# EAGLE schematic PTGSCH1 (EAGLE 7.7.0)

## Sheet 1 of 2
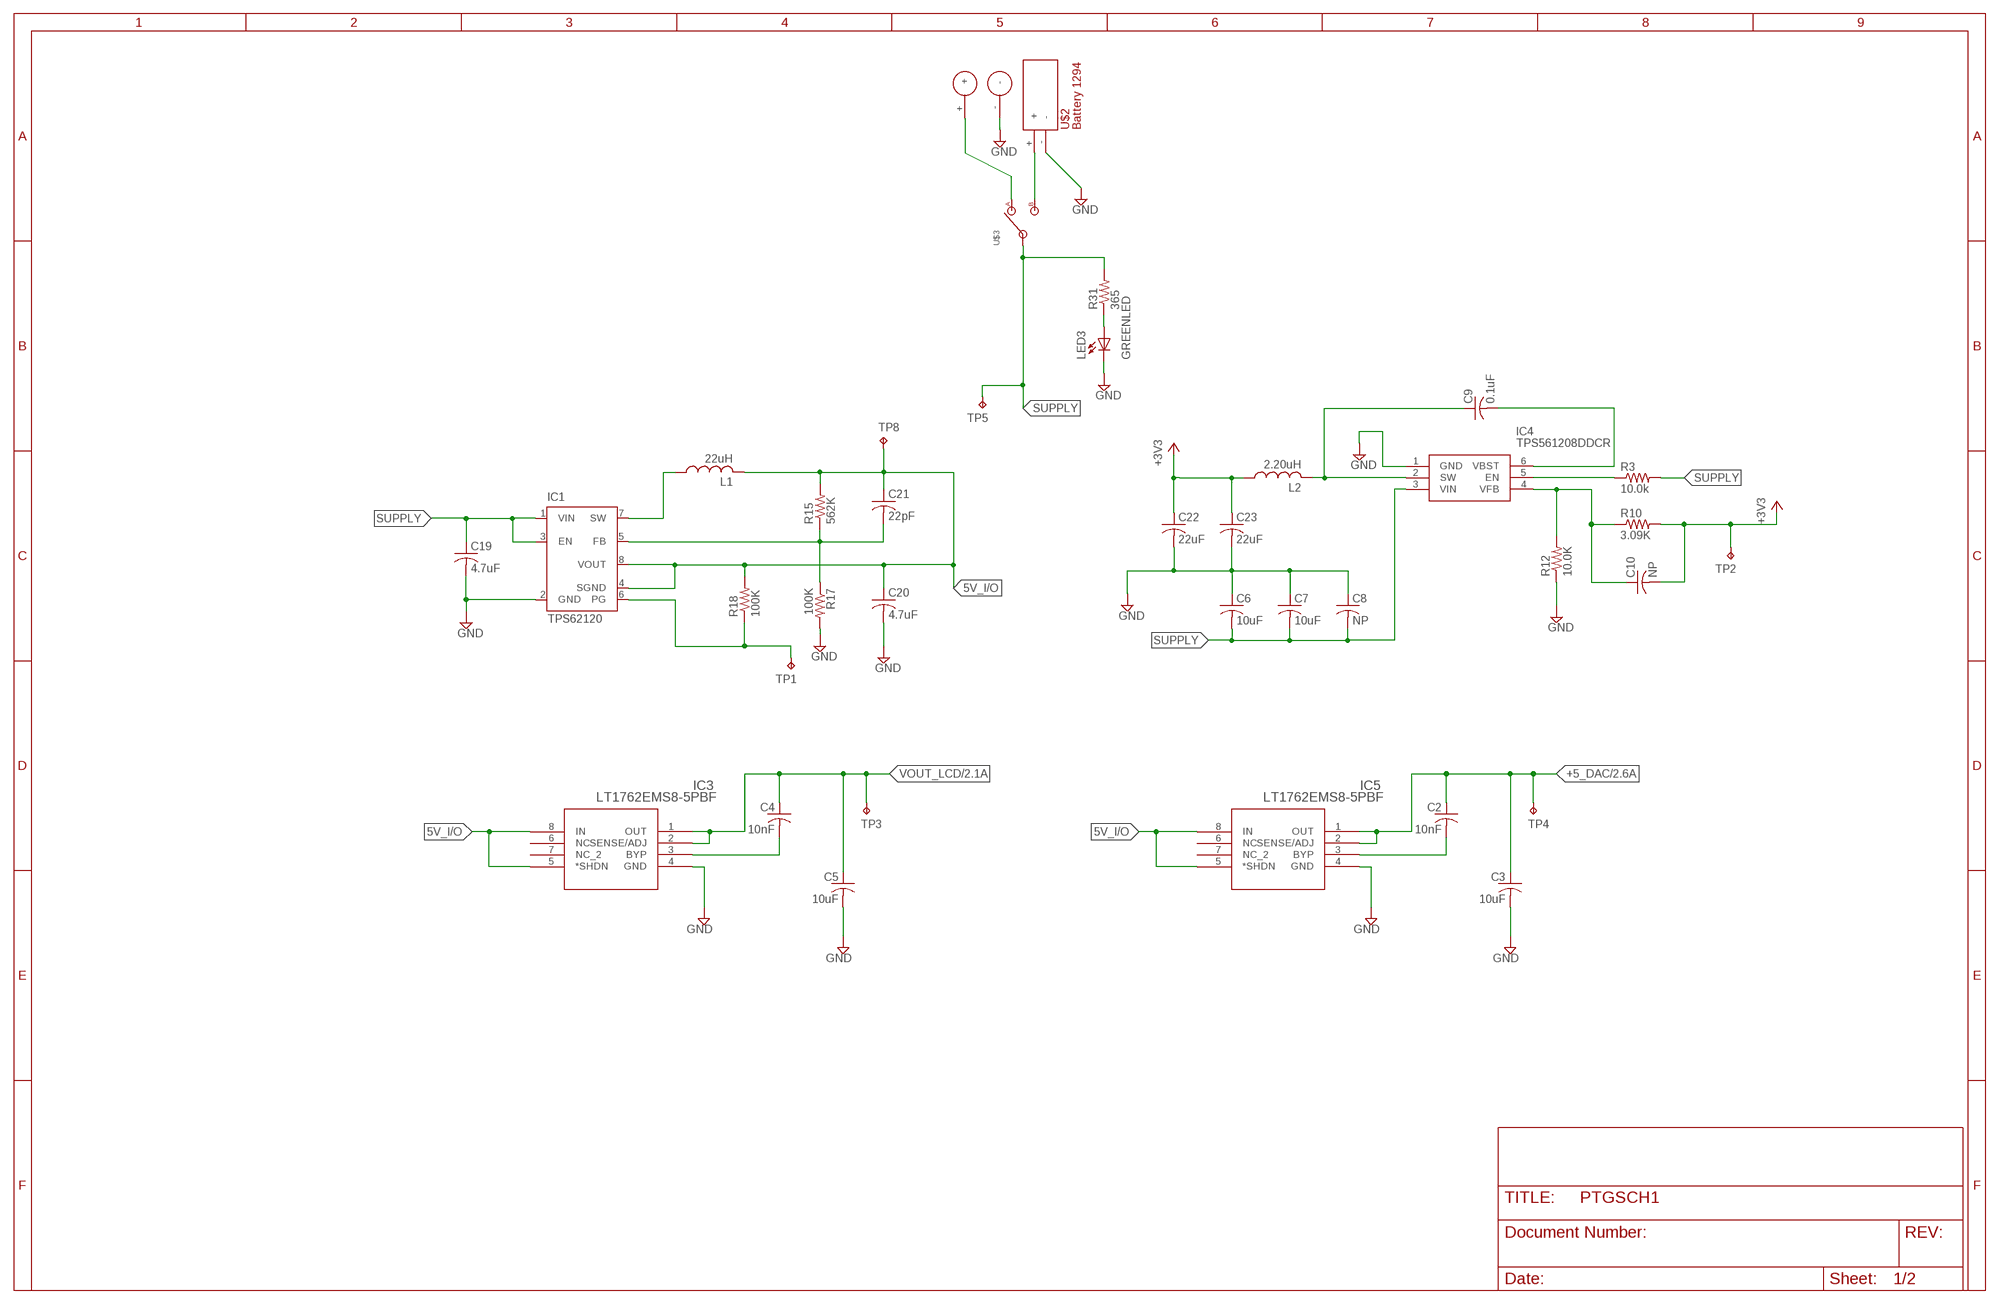
[diagram p0: schematic, sheet 1]

### Parts
C2  10nF  C-USC0603  [C0603]
C3  10uF  C-USC0805  [C0805]
C4  10nF  C-USC0603  [C0603]
C5  10uF  C-USC0805  [C0805]
C6  10uF  C-USC0805  [C0805]
C7  10uF  C-USC0805  [C0805]
C8  NP  C-USC0805  [C0805]
C9  0.1uF  C-USC0805  [C0805]
C10  NP  C-USC0805  [C0805]
C19  4.7uF  C-USC0603  [C0603]
C20  4.7uF  C-USC0603  [C0603]
C21  22pF  C-USC0603  [C0603]
C22  22uF  C-USC0603  [C0603]
C23  22uF  C-USC0603  [C0603]
IC1  TPS62120  [DCN-R-PDSO-G8]
IC3  LT1762EMS8-5PBF  [MSOP-8_MS]
IC4  TPS561208DDCR  [SOT95P280X110-6N]
IC5  LT1762EMS8-5PBF  [MSOP-8_MS]
L1  22uH  L-US0603  [C0603K]
L2  2.20uH  L-US0603  [C0603K]
LED3  GREENLED  [0805_10MGAP]
R3  10.0k  R-US_R0603  [R0603]
R10  3.09K  R-US_R0603  [R0603]
R12  10.0K  R-US_R0603  [R0603]
R15  562K  R-US_R0603  [R0603]
R17  100K  R-US_R0603  [R0603]
R18  100K  R-US_R0603  [R0603]
R31  365  R-US_R0603  [R0603]
TP1  TPTP20SQ  [TP20SQ]
TP2  TPTP20SQ  [TP20SQ]
TP3  TPTP20SQ  [TP20SQ]
TP4  TPTP20SQ  [TP20SQ]
TP5  TPTP20SQ  [TP20SQ]
TP8  TPTP20SQ  [TP20SQ]
U$2  BATTERY_HOLDER  [HOLDER]
U$3  POWERSWITCH  [ROCKERVIAS]
U$4  POWRPINS  [VOLTAGEPINS]

### Nets
5V_I/O: C20.1 C21.1 IC1.4(SGND) IC1.8(VOUT) IC3.5(*SHDN) IC3.8(IN) IC5.5(*SHDN) IC5.8(IN) L1.2 R15.2 R18.2 TP8.TP
+3V3: C10.2 C22.1 C23.1 L2.1 R10.2 TP2.TP ; also sheet 2
+5_DAC: C2.1 C3.1 IC5.1(OUT) IC5.2(SENSE/ADJ) TP4.TP ; also sheet 2
ADD_TEST_PAD: IC1.6(PG) R18.1 TP1.TP
GND: C3.2 C5.2 C6.1 C7.1 C8.1 C19.2 C20.2 C22.2 C23.2 IC1.2(GND) IC3.4(GND) IC4.1(GND) IC5.4(GND) LED3.1(-) R12.1 R17.2 U$2.- U$4.- ; also sheet 2
N$1: U$2.+ U$3.3
N$2: C10.1 IC4.4(VFB) R10.1 R12.2
N$4: C9.1 IC4.2(SW) L2.2
N$5: C9.2 IC4.6(VBST)
N$6: IC4.5(EN) R3.1
N$7: IC1.7(SW) L1.1
N$8: C21.2 IC1.5(FB) R15.1 R17.1
N$9: C2.2 IC5.3(BYP)
N$13: LED3.2(+) R31.1
N$23: C4.2 IC3.3(BYP)
PWR_PINS: U$3.1 U$4.+
SUPPLY: C6.2 C7.2 C8.2 C19.1 IC1.1(VIN) IC1.3(EN) IC4.3(VIN) R3.2 R31.2 TP5.TP U$3.2
VOUT_LCD: C4.1 C5.1 IC3.1(OUT) IC3.2(SENSE/ADJ) TP3.TP ; also sheet 2
Unconnected: IC3.6(NC) IC3.7(NC_2) IC5.6(NC) IC5.7(NC_2)

## Sheet 2 of 2
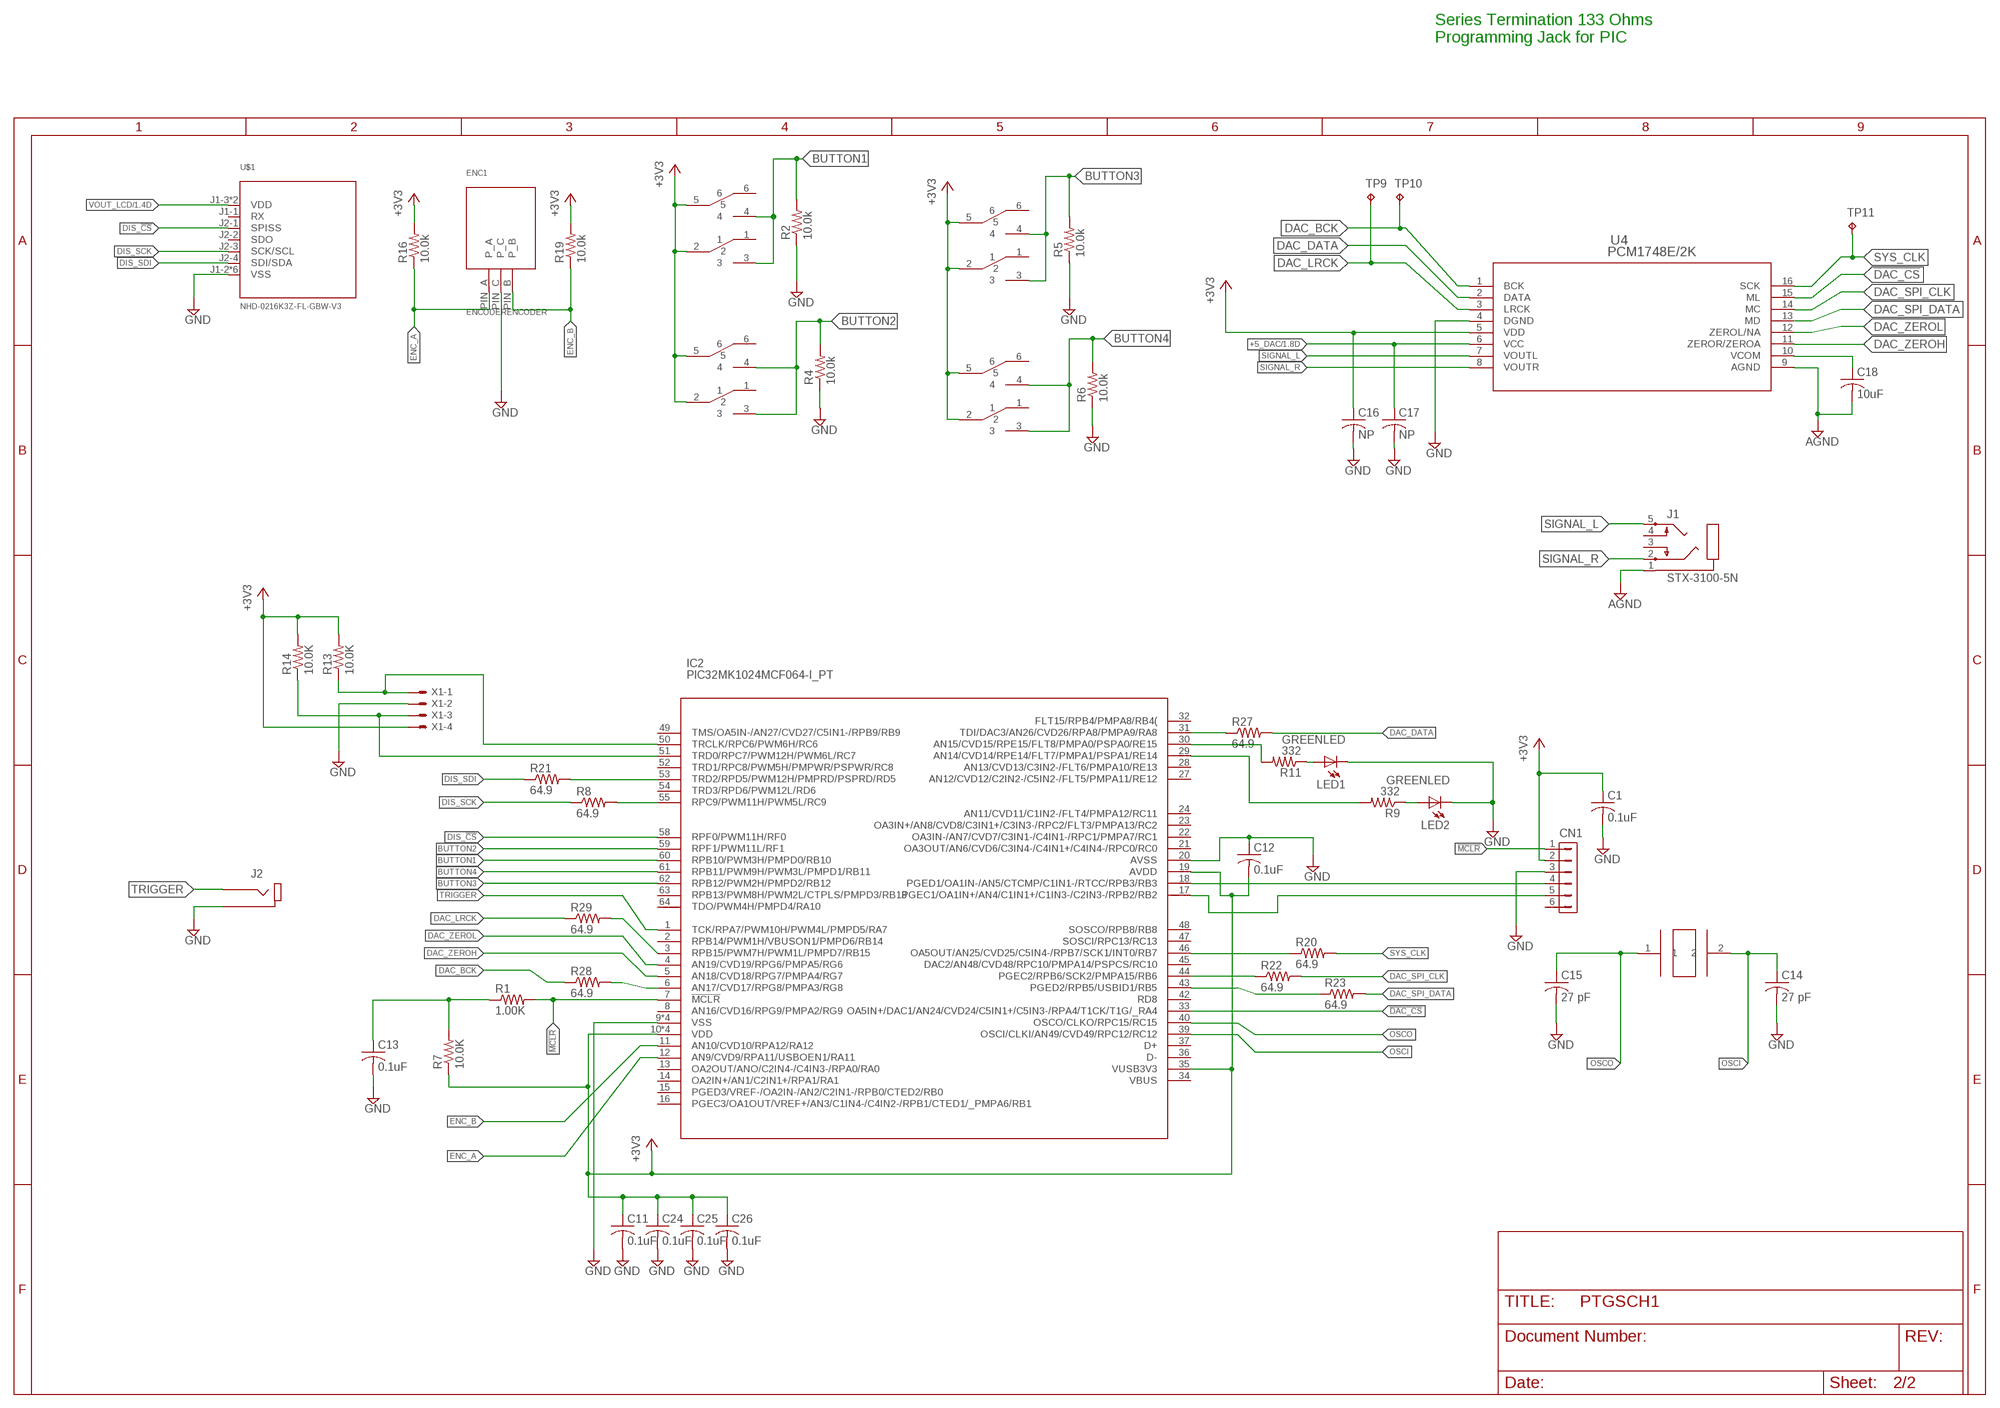
[diagram p1: schematic, sheet 2]

### Parts
BUTTON1  BUTTON-DPDT-7MM  [BUTTON-DPDT-7MM]
BUTTON2  BUTTON-DPDT-7MM  [BUTTON-DPDT-7MM]
BUTTON3  BUTTON-DPDT-7MM  [BUTTON-DPDT-7MM]
BUTTON4  BUTTON-DPDT-7MM  [BUTTON-DPDT-7MM]
C1  0.1uF  C-USC0805  [C0805]
C11  0.1uF  C-USC0805  [C0805]
C12  0.1uF  C-USC0805  [C0805]
C13  0.1uF  C-USC0805  [C0805]
C14  27 pF  C-USC0603  [C0603]
C15  27 pF  C-USC0603  [C0603]
C16  NP  C-USC0805  [C0805]
C17  NP  C-USC0805  [C0805]
C18  10uF  C-USC0805  [C0805]
C24  0.1uF  C-USC0805  [C0805]
C25  0.1uF  C-USC0805  [C0805]
C26  0.1uF  C-USC0805  [C0805]
CN1  HDR-1X6-SIP-100  [SIP-100-6V]
ENC1  ENCODERENCODER  [ENCODER]
IC2  PIC32MK1024MCF064-I_PT  [TQFP64-10X10]
J1  STX-3100-5N  [STX-3100-5N]
J2  RCJ-01X_PHONO_SINGLE  [RCA_RA_PCB_SINGLE]
LED1  GREENLED  [0805_10MGAP]
LED2  GREENLED  [0805_10MGAP]
R1  1.00K  R-US_R0603  [R0603]
R2  10.0k  R-US_R0603  [R0603]
R4  10.0k  R-US_R0603  [R0603]
R5  10.0k  R-US_R0603  [R0603]
R6  10.0k  R-US_R0603  [R0603]
R7  10.0K  R-US_R0603  [R0603]
R8  64.9  R-US_R0603  [R0603]
R9  332  R-US_R0603  [R0603]
R11  332  R-US_R0603  [R0603]
R13  10.0K  R-US_R0603  [R0603]
R14  10.0K  R-US_R0603  [R0603]
R16  10.0k  R-US_R0603  [R0603]
R19  10.0k  R-US_R0603  [R0603]
R20  64.9  R-US_R0603  [R0603]
R21  64.9  R-US_R0603  [R0603]
R22  64.9  R-US_R0603  [R0603]
R23  64.9  R-US_R0603  [R0603]
R27  64.9  R-US_R0603  [R0603]
R28  64.9  R-US_R0603  [R0603]
R29  64.9  R-US_R0603  [R0603]
TP9  TPTP20SQ  [TP20SQ]
TP10  TPTP20SQ  [TP20SQ]
TP11  TPTP20SQ  [TP20SQ]
U4  PCM1748E/2K  [DBQ16]
U$1  NHD-0216K3Z-FL-GBW-V3  [NHD-0216K3Z-FL-GBW-V3]
U$8  EXTERNALCRYSTAL  [XTAL500X320X130N]
X1  22-23-2041  [22-23-2041]

### Nets
!DAC_CS: IC2.33(OA5IN+/DAC1/AN24/CVD24/C5IN1+/C5IN3-/RPA4/T1CK/T1G/_RA4) U4.15(ML)
!MCLR: CN1.1 IC2.7(!MCLR) R1.2
+3V3: BUTTON1.2 BUTTON1.5 BUTTON2.2 BUTTON2.5 BUTTON3.2 BUTTON3.5 BUTTON4.2 BUTTON4.5 C1.1 C11.1 C12.2 C16.1 C24.1 C25.1 C26.1 CN1.2 IC2.10(VDD) IC2.19(AVDD) IC2.26(VDD) IC2.35(VUSB3V3) IC2.38(VDD) IC2.57(VDD) R7.1 R13.2 R14.2 R16.2 R19.2 U4.5(VDD) X1.4 ; also sheet 1
+5_DAC: C17.1 U4.6(VCC) ; also sheet 1
AGND: C18.2 J1.1 U4.9(AGND)
BUTTON1: BUTTON1.3 BUTTON1.4 IC2.60(RPB10/PWM3H/PMPD0/RB10) R2.2
BUTTON2: BUTTON2.3 BUTTON2.4 IC2.59(RPF1/PWM11L/RF1) R4.2
BUTTON3: BUTTON3.3 BUTTON3.4 IC2.62(RPB12/PWM2H/PMPD2/RB12) R5.2
BUTTON4: BUTTON4.3 BUTTON4.4 IC2.61(RPB11/PWM9H/PWM3L/PMPD1/RB11) R6.2
DAC_BCK: R28.1 TP10.TP U4.1(BCK)
DAC_DATA: R27.2 U4.2(DATA)
DAC_LRCK: R29.1 TP9.TP U4.3(LRCK)
DAC_SPI_CLK: R22.2 U4.14(MC)
DAC_SPI_DATA: R23.2 U4.13(MD)
DAC_ZEROH: IC2.5(AN18/CVD18/RPG7/PMPA4/RG7) U4.11(ZEROR/ZEROA)
DAC_ZEROL: IC2.4(AN19/CVD19/RPG6/PMPA5/RG6) U4.12(ZEROL/NA)
DIS_!CS: IC2.58(RPF0/PWM11H/RF0) U$1.J2-1(SPISS)
DIS_SCK: R8.1 U$1.J2-3(SCK/SCL)
DIS_SDI: R21.1 U$1.J2-4(SDI/SDA)
ENC_A: ENC1.PIN_A(P_A) IC2.12(AN9/CVD9/RPA11/USBOEN1/RA11) R16.1
ENC_B: ENC1.PIN_B(P_B) IC2.11(AN10/CVD10/RPA12/RA12) R19.1
GND: C1.2 C11.2 C12.1 C13.2 C14.2 C15.2 C16.2 C17.2 C24.2 C25.2 C26.2 CN1.3 ENC1.PIN_C(P_C) IC2.9(VSS) IC2.20(AVSS) IC2.25(VSS) IC2.41(VSS) IC2.56(VSS) J2.1(SH) LED1.1(-) LED2.1(-) R2.1 R4.1 R5.1 R6.1 U4.4(DGND) U$1.J1-2(VSS) U$1.J2-5(VSS) U$1.M1(VSS) U$1.M2(VSS) U$1.M3(VSS) U$1.M4(VSS) X1.2 ; also sheet 1
N$3: IC2.55(RPC9/PWM11H/PWM5L/RC9) R8.2
N$10: IC2.53(TRD2/RPD5/PWM12H/PMPRD/PSPRD/RD5) R21.2
N$11: LED2.2(+) R9.1
N$12: LED1.2(+) R11.1
N$14: IC2.46(OA5OUT/AN25/CVD25/C5IN4-/RPB7/SCK1/INT0/RB7) R20.1
N$15: IC2.30(AN15/CVD15/RPE15/FLT8/PMPA0/PSPA0/RE15) R11.2
N$16: CN1.5 IC2.17(PGEC1/OA1IN+/AN4/C1IN1+/C1IN3-/C2IN3-/RPB2/RB2)
N$17: IC2.29(AN14/CVD14/RPE14/FLT7/PMPA1/PSPA1/RE14) R9.2
N$18: C13.1 R1.1 R7.2
N$19: C18.1 U4.10(VCOM)
N$20: IC2.3(RPB15/PWM7H/PWM1L/PMPD7/RB15) R29.2
N$21: IC2.44(PGEC2/RPB6/SCK2/PMPA15/RB6) R22.1
N$25: CN1.4 IC2.18(PGED1/OA1IN-/AN5/CTCMP/C1IN1-/RTCC/RPB3/RB3)
N$27: IC2.43(PGED2/RPB5/USBID1/RB5) R23.1
N$30: IC2.31(TDI/DAC3/AN26/CVD26/RPA8/PMPA9/RA8) R27.1
N$31: IC2.6(AN17/CVD17/RPG8/PMPA3/RG8) R28.2
OSCI: C14.1 IC2.39(OSCI/CLKI/AN49/CVD49/RPC12/RC12) U$8.2
OSCO: C15.1 IC2.40(OSCO/CLKO/RPC15/RC15) U$8.1
SIGNAL_L: J1.5 U4.7(VOUTL)
SIGNAL_R: J1.2 U4.8(VOUTR)
SYS_CLK: R20.2 TP11.TP U4.16(SCK)
TRIGGER: IC2.1(TCK/RPA7/PWM10H/PWM4L/PMPD5/RA7) J2.2(PIN)
UART-RX: IC2.50(TRCLK/RPC6/PWM6H/RC6) R13.1 X1.1
UART-TX: IC2.51(TRD0/RPC7/PWM12H/PWM6L/RC7) R14.1 X1.3
VOUT_LCD: U$1.J1-3(VDD) U$1.J2-6(VDD) ; also sheet 1
Unconnected: BUTTON1.1 BUTTON1.6 BUTTON2.1 BUTTON2.6 BUTTON3.1 BUTTON3.6 BUTTON4.1 BUTTON4.6 CN1.6 IC2.2(RPB14/PWM1H/VBUSON1/PMPD6/RB14) IC2.8(AN16/CVD16/RPG9/PMPA2/RG9) IC2.13(OA2OUT/ANO/C2IN4-/C4IN3-/RPA0/RA0) IC2.14(OA2IN+/AN1/C2IN1+/RPA1/RA1) IC2.15(PGED3/VREF-/OA2IN-/AN2/C2IN1-/RPB0/CTED2/RB0) IC2.16(PGEC3/OA1OUT/VREF+/AN3/C1IN4-/C4IN2-/RPB1/CTED1/_PMPA6/RB1) IC2.21(OA3OUT/AN6/CVD6/C3IN4-/C4IN1+/C4IN4-/RPC0/RC0) IC2.22(OA3IN-/AN7/CVD7/C3IN1-/C4IN1-/RPC1/PMPA7/RC1) IC2.23(OA3IN+/AN8/CVD8/C3IN1+/C3IN3-/RPC2/FLT3/PMPA13/RC2) IC2.24(AN11/CVD11/C1IN2-/FLT4/PMPA12/RC11) IC2.27(AN12/CVD12/C2IN2-/C5IN2-/FLT5/PMPA11/RE12) IC2.28(AN13/CVD13/C3IN2-/FLT6/PMPA10/RE13) IC2.32(FLT15/RPB4/PMPA8/RB4() IC2.34(VBUS) IC2.36(D-) IC2.37(D+) IC2.42(RD8) IC2.45(DAC2/AN48/CVD48/RPC10/PMPA14/PSPCS/RC10) IC2.47(SOSCI/RPC13/RC13) IC2.48(SOSCO/RPB8/RB8) IC2.49(TMS/OA5IN-/AN27/CVD27/C5IN1-/RPB9/RB9) IC2.52(TRD1/RPC8/PWM5H/PMPWR/PSPWR/RC8) IC2.54(TRD3/RPD6/PWM12L/RD6) IC2.63(RPB13/PWM8H/PWM2L/CTPLS/PMPD3/RB13) IC2.64(TDO/PWM4H/PMPD4/RA10) J1.3 J1.4 U$1.J1-1(RX) U$1.J2-2(SDO)

### Notes on the sheet
- Series Termination 133 Ohms
- Programming Jack for PIC

## Power pins joined to a net without a drawn wire
GND: J2.3(GND) J2.4(GND)

## Library data of the parts
BUTTON1-BUTTON4 = button-dpdt-7mm:BUTTON-DPDT-7MM
C1-C26 = rcl:C-US: CAPACITOR, American symbol
CN1 = con-hdrs40:HDR-1X6: HEADER CONNECTOR
ENC1 = ENCODER_PTG:ENCODER
IC1 = texas:TPS62120: 15V, 75mA High Efficient Buck Converter Source: tps62120.pdf (www.ti.com)
IC2 = PIC_FORREAL:PIC32MK1024MCF064-I_PT: MICROCHIP - PIC32MK1024MCF064-I/PT - MCU, 32BIT, PIC32, 120MHZ, TQFP-64 Source: Datasheet <http://ww1.microchip.com/downloads/en/DeviceDoc/60001402D.pdf>
IC3 IC5 = LDO:LT1762EMS8-5PBF; AVAILABILITY: Good; DESCRIPTION: PMIC - LDO voltage regulator Linear Technology LT1762EMS8-5#PBF Positive, fixed MSOP 8; MF: Linear Technology; MP: LT1762EMS8-5#PBF; PACKAGE: TSSOP-8 Linear Technology; PRICE: 1.89 USD
IC4 = TPS561208DDCR:TPS561208DDCR: 4.5V to 17V Input, 2A Output, Synchronous SWIFT Step-Down Converter Source: Datasheet <http://www.ti.com/lit/gpn/tps561208>; DESCRIPTION: 4.5V to 17V Input, 2A Output, Synchronous SWIFT Step-Down Converter; HEIGHT: 1.1mm; MANUFACTURER_NAME: Texas Instruments; MANUFACTURER_PART_NUMBER: TPS561208DDCR
J1 = NewSDR:STX-3100-*: KYCON 3.5mm Stereo Jack
J2 = RCA:RCJ-01X_PHONO_SINGLE: CUI Single R/A RCA Jack
L1 L2 = NewSDR:L-US: SMD Chip Inductor
LED1-LED3 = GreenLED:GREENLED
R1 R3 R7 R10 R12 R15 R17 R18 R31 = resistor:R-US_: RESISTOR, American symbol
R2 R4-R6 R8 R9 R11 R13 R14 R16 R19-R23 R27-R29 = rcl:R-US_: RESISTOR, American symbol
TP1-TP5 TP8-TP11 = testpad:TP: Test pad
U4 = PCM1748:PCM1748E/2K; MANUFACTURER_PART_NUMBER: PCM1748E2K; VENDOR: Texas Instruments
U$1 = realdisplay:NHD-0216K3Z-FL-GBW-V3
U$2 = BattHolder:BATTERY_HOLDER
U$3 = RockerSwitch:POWERSWITCH
U$4 = POWERPINS:POWRPINS
U$8 = XTAL500X320X130N:EXTERNALCRYSTAL
X1 = 22-23-2041:22-23-2041: .100" (2.54mm) Center Header - 4 Pin; AVAILABILITY: Good; DESCRIPTION: KK® 254 Solid Header, Vertical, with Friction Lock, 4 Circuits, Tin _Sn_ Plating; MF: Molex; MP: 22-23-2041; PACKAGE: None; PRICE: 0.14 USD